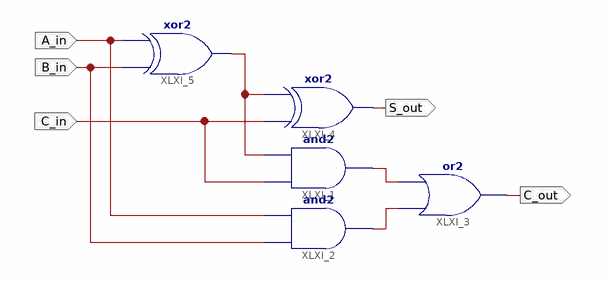
[diagram p0: schematic sheet 1]
// Xilinx ISE schematic fulladd.sch (spartan6) as structural Verilog: 5 symbols, 5 ports
module fulladd (
  input  B_in,
  input  A_in,
  input  C_in,
  output S_out,
  output C_out
);

  wire XLXN_1, XLXN_12, XLXN_13;

  and XLXI_1 (XLXN_12, C_in, XLXN_1);
  and XLXI_2 (XLXN_13, B_in, A_in);
  or XLXI_3 (C_out, XLXN_13, XLXN_12);
  xor XLXI_4 (S_out, C_in, XLXN_1);
  xor XLXI_5 (XLXN_1, B_in, A_in);
endmodule
